# Altium schematic sheet Power.SchDoc
size A3
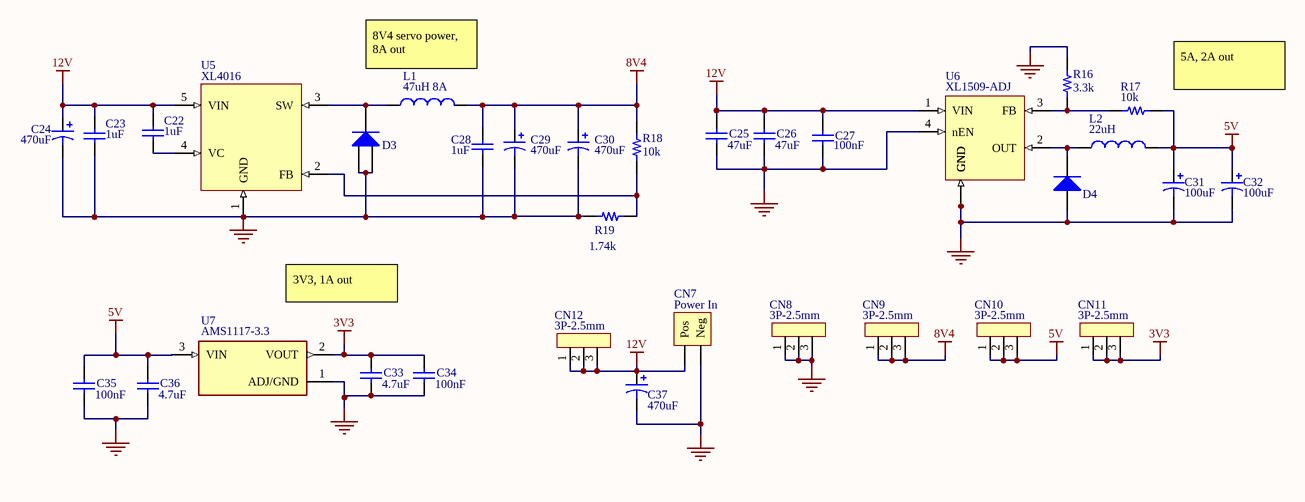
[diagram p0: Power.SchDoc]

## Parts
C22  value 1uF  [0402]  (hidden comment: Cap)
C23  value 1uF  [0402]  (hidden comment: Cap)
C24  470uF  [10x12mm-Electrolytic]
C25  value 47uF  [1206]  (hidden comment: Cap)
C26  value 47uF  [1206]  (hidden comment: Cap)
C27  value 100nF  [0402]  (hidden comment: Cap)
C28  value 1uF  [0402]  (hidden comment: Cap)
C29  470uF  [10x12mm-Electrolytic]
C30  470uF  [10x12mm-Electrolytic]
C31  100uF  [8x10.2 Cap]
C32  100uF  [8x10.2 Cap]
C33  value 4.7uF  [0805 - duplicate]  (hidden comment: Cap)
C34  value 100nF  [0402]  (hidden comment: Cap)
C35  value 100nF  [0402]  (hidden comment: Cap)
C36  value 4.7uF  [0805 - duplicate]  (hidden comment: Cap)
C37  470uF  [10x12mm-Electrolytic]
CN7  Power In  [Power_Leads]
CN8  3P-2.5mm  [2.5mm-3P]
CN9  3P-2.5mm  [2.5mm-3P]
CN10  3P-2.5mm  [2.5mm-3P]
CN11  3P-2.5mm  [2.5mm-3P]
CN12  3P-2.5mm  [2.5mm-3P]
D3  Diode  [PowerDi5]  (value not drawn)
D4  SS24  [DO-214AA]  (value not drawn)
L1  47uH 8A  [18x16-9-Inductor]
L2  22uH  [71x66-Inductor]
R16  3.3k  [0805 - duplicate]
R17  10k  [0805 - duplicate]
R18  10k  [0805 - duplicate]
R19  1.74k  [0805 - duplicate]
U5  XL4016  [TO220-5L]
U6  XL1509-ADJ  [SOP8-MT3420]
U7  AMS1117-3.3  [SOT229P700X180-4N]

## Nets
3V3: C33.2 C34.2 CN11.1 CN11.2 CN11.3 U7.2(VOUT)
5V: C31.1 C32.1 C35.2 C36.2 CN10.1 CN10.2 CN10.3 L2.2 R17.2 U7.3(VIN)
8V4: C28.2 C29.1 C30.1 CN9.1 CN9.2 CN9.3 L1.2 R18.2
12V: C22.2 C23.2 C24.1 C25.2 C26.2 C27.2 C37.1 CN7.A(Pos) CN12.1 CN12.2 CN12.3 U5.5(VIN) U6.1(VIN)
GND: C23.1 C24.2 C25.1 C26.1 C27.1 C28.1 C29.2 C30.2 C31.2 C32.2 C33.1 C34.1 C35.1 C36.1 C37.2 CN7.K(Neg) CN8.1 CN8.2 CN8.3 D3.1(A) D3.2(A) D4.A R16.2 R19.1 U5.1(GND) U6.4(nEN) U6.5(GND) U6.6(GND) U6.7(GND) U6.8(GND) U7.1(ADJ/GND)
NetC22_1: C22.1 U5.4(VC)
NetD3_3: D3.3(K) L1.1 U5.3(SW)
NetD4_K: D4.K L2.1 U6.2(OUT)
NetR16_1: R16.1 R17.1 U6.3(FB)
NetR18_1: R18.1 R19.2 U5.2(FB)

## Notes on the sheet
- (near L1) 8V4 servo power, 8A out
- (near R17) 5A, 2A out
- 3V3, 1A out

## Library data of the parts
C24 C29-C32 C37 = Polarised Capacitor
CN7 = JST_Leads_In
D4 = SS24: 2A Schottky Diode
L1 = SMD Inductor 18x16.9: TMPC1707
L2 = 22uH Inductor, 7.1*6.6
R16-R19 = Resistor
U5 = XL4016: 8A Buck COnverter
U6 = XL1509-5
U7 = AMS1117-3.3: Sot223/Pkg 1-Amp 3.3-Volt Low Drop Out Voltage Regulatator; MF: Advanced Monolithic Systems; Price: None; Package: None; Value: *; MP: AMS1117-3.3; Availability: Unavailable; SnapEDA_Link: https://www.snapeda.com/parts/AMS1117-3.3/Advanced%20Monolithic%20Systems/view-part/53450/?ref=snap
C22 C23 C25-C28 C33-C36 = Cap: Published: 8-Jun-2000; LatestRevisionDate: 17-Jul-2002; LatestRevisionNote: Re-released for DXP Platform.; PackageReference: RAD-0.3; Publisher: Altium Limited; PackageDescription: Radial Cap, Thru-Hole; 2 Leads; 0.3 in Pin Spacing
D3 = Diode: Published: 8-Jun-2000; LatestRevisionDate: 17-Jul-2002; LatestRevisionNote: Re-released for DXP Platform.; PackageVersion: Sep-1996; PackageReference: SMC; Publisher: Altium Limited; PackageDescription: DO-214-AB/SMC; 2 C-Bend Leads; Body 7.9 x 5.9 mm, inc. leads (LxW); Code_JEDEC: DO-214-AB